# Altium schematic sheet 2020-01-06_12-17-201.schdoc
size 208 x 111 mm; SheetNumber: 1; SheetTotal: 1
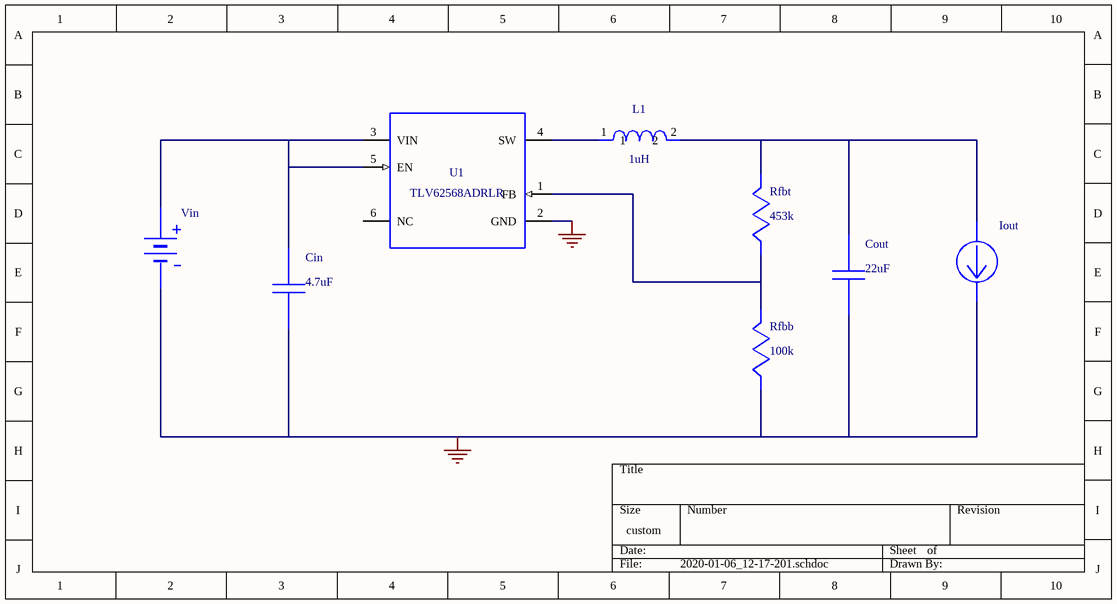
[diagram p0: 2020-01-06_12-17-201.schdoc]

## Parts
Cin  value 4.7uF  (hidden comment: C1005X5R1A475K050BC)
Cout  value 22uF  (hidden comment: GRM188R60J226MEA0D)
Iout  WB_CURRENT_LOAD  (value not drawn)
L1  value 1uH  (hidden comment: DFE252012F-1R0M=P2)
Rfbb  value 100k  (hidden comment: CRCW0402100KFKED)
Rfbt  value 453k  (hidden comment: CRCW0402453KFKED)
U1  TLV62568ADRLR
Vin  WB_BATTERY  (value not drawn)

## Nets
0: Cin.2 Cout.2 Iout.2(-) Rfbb.2 U1.2(GND) Vin.2(-)
NetCin_1: Cin.1 U1.3(VIN) U1.5(EN) Vin.1(+)
NetCout_1: Cout.1 Iout.1(+) L1.2 Rfbt.1
NetL1_1: L1.1 U1.4(SW)
NetRfbb_1: Rfbb.1 Rfbt.2 U1.1(FB)

Not connected (* = marked no-connect by the designer): U1 6(NC)

## Library data of the parts
Cin = C1005X5R1A475K050BC: C1005X5R1A475K05; Manufacturer Name: TDK; PackageReference: C1005X5R1A475K050BC; Manufacturer Part Number: C1005X5R1A475K050BC
Cout = GRM188R60J226MEA0D: GRM188R60J226MEA; Manufacturer Name: MuRata; PackageReference: GRM188R60J226MEA0D; Manufacturer Part Number: GRM188R60J226MEA0D
L1 = DFE252012F-1R0M=P2: DFE252012F-1R0M=; Manufacturer Name: MuRata Toko; PackageReference: DFE252012F-1R0M=P2; Manufacturer Part Number: DFE252012F-1R0M=P2
Rfbb = CRCW0402100KFKED: Manufacturer Name: Vishay-Dale; PackageReference: CRCW0402100KFKED; Manufacturer Part Number: CRCW0402100KFKED
Rfbt = CRCW0402453KFKED: Manufacturer Name: Vishay-Dale; PackageReference: CRCW0402453KFKED; Manufacturer Part Number: CRCW0402453KFKED
U1 = TLV62568ADRLR: Manufacturer Name: Texas Instruments; PackageReference: TLV62568ADRLR; Manufacturer Part Number: TLV62568ADRLR; Value: N/A
Iout = WB_CURRENT_LOAD: PackageReference: WB_CURRENT_LOAD; Manufacturer Part Number: WB_CURRENT_LOAD; Manufacturer Name: WB_CURRENT_LOAD; Value: N/A
Vin = WB_BATTERY: PackageReference: WB_BATTERY; Manufacturer Part Number: WB_BATTERY; Manufacturer Name: WB_BATTERY; Value: N/A